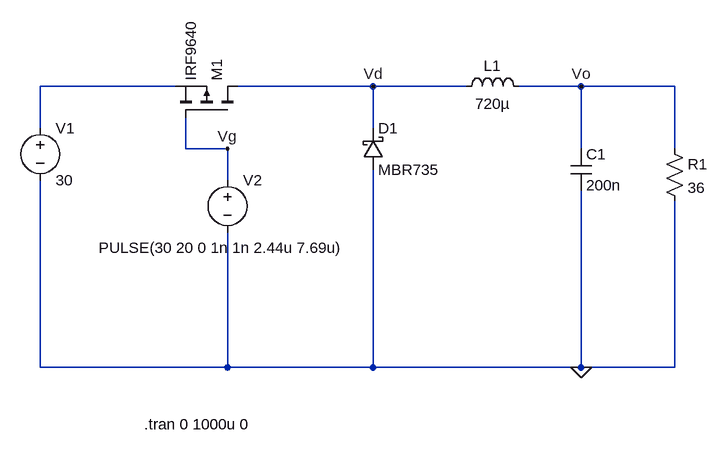
[diagram p0: schematic Buck-converter.asc]
Buck-converter.asc, the LTspice schematic file:
Version 4.1
SHEET 1 1084 680
WIRE 240 48 32 48
WIRE 544 48 336 48
WIRE 688 48 544 48
WIRE 864 48 768 48
WIRE 1008 48 864 48
WIRE 32 112 32 48
WIRE 544 112 544 48
WIRE 256 144 256 96
WIRE 320 144 256 144
WIRE 864 144 864 48
WIRE 1008 144 1008 48
WIRE 320 192 320 144
WIRE 32 480 32 192
WIRE 320 480 320 272
WIRE 320 480 32 480
WIRE 544 480 544 176
WIRE 544 480 320 480
WIRE 864 480 864 208
WIRE 864 480 544 480
WIRE 1008 480 1008 224
WIRE 1008 480 864 480
FLAG 864 480 0
FLAG 864 48 Vo
FLAG 320 144 Vg
FLAG 544 48 Vd
SYMBOL voltage 32 96 R0
WINDOW 123 0 0 Left 0
WINDOW 39 0 0 Left 0
SYMATTR InstName V1
SYMATTR Value 30
SYMBOL voltage 320 176 R0
WINDOW 3 -198 120 Left 2
WINDOW 123 0 0 Left 0
WINDOW 39 0 0 Left 0
SYMATTR Value PULSE(30 20 0 1n 1n 2.44u 7.69u)
SYMATTR InstName V2
SYMBOL schottky 528 176 M180
WINDOW 0 24 64 Left 2
WINDOW 3 24 0 Left 2
SYMATTR InstName D1
SYMATTR Value MBR735
SYMATTR Description Diode
SYMATTR Type diode
SYMBOL ind 672 64 R270
WINDOW 0 32 56 VTop 2
WINDOW 3 5 56 VBottom 2
SYMATTR InstName L1
SYMATTR Value 720µ
SYMBOL cap 848 144 R0
SYMATTR InstName C1
SYMATTR Value 200n
SYMBOL pmos 336 96 M270
SYMATTR InstName M1
SYMATTR Value IRF9640
SYMBOL res 992 128 R0
SYMATTR InstName R1
SYMATTR Value 36
TEXT 192 568 Left 2 !.tran 0 1000u 0

The netlist it stands for:
* Buck-converter.asc
V1 N001 0 30
V2 Vg 0 PULSE(30 20 0 1n 1n 2.44u 7.69u)
D1 0 Vd MBR735
L1 Vd Vo 720µ
C1 Vo 0 200n
M1 Vd Vg N001 N001 IRF9640
R1 Vo 0 36
.model D D
.lib standard.dio
.model NMOS NMOS
.model PMOS PMOS
.lib standard.mos
.tran 0 1000u 0
.backanno
.end